# Altium schematic sheet valves.SchDoc: PARSEC Valve Board
size A; Author: Lorenzo; DrawnBy: Lorenzo Shaikewitz; DocumentNumber: Valve Connections; Revision: A
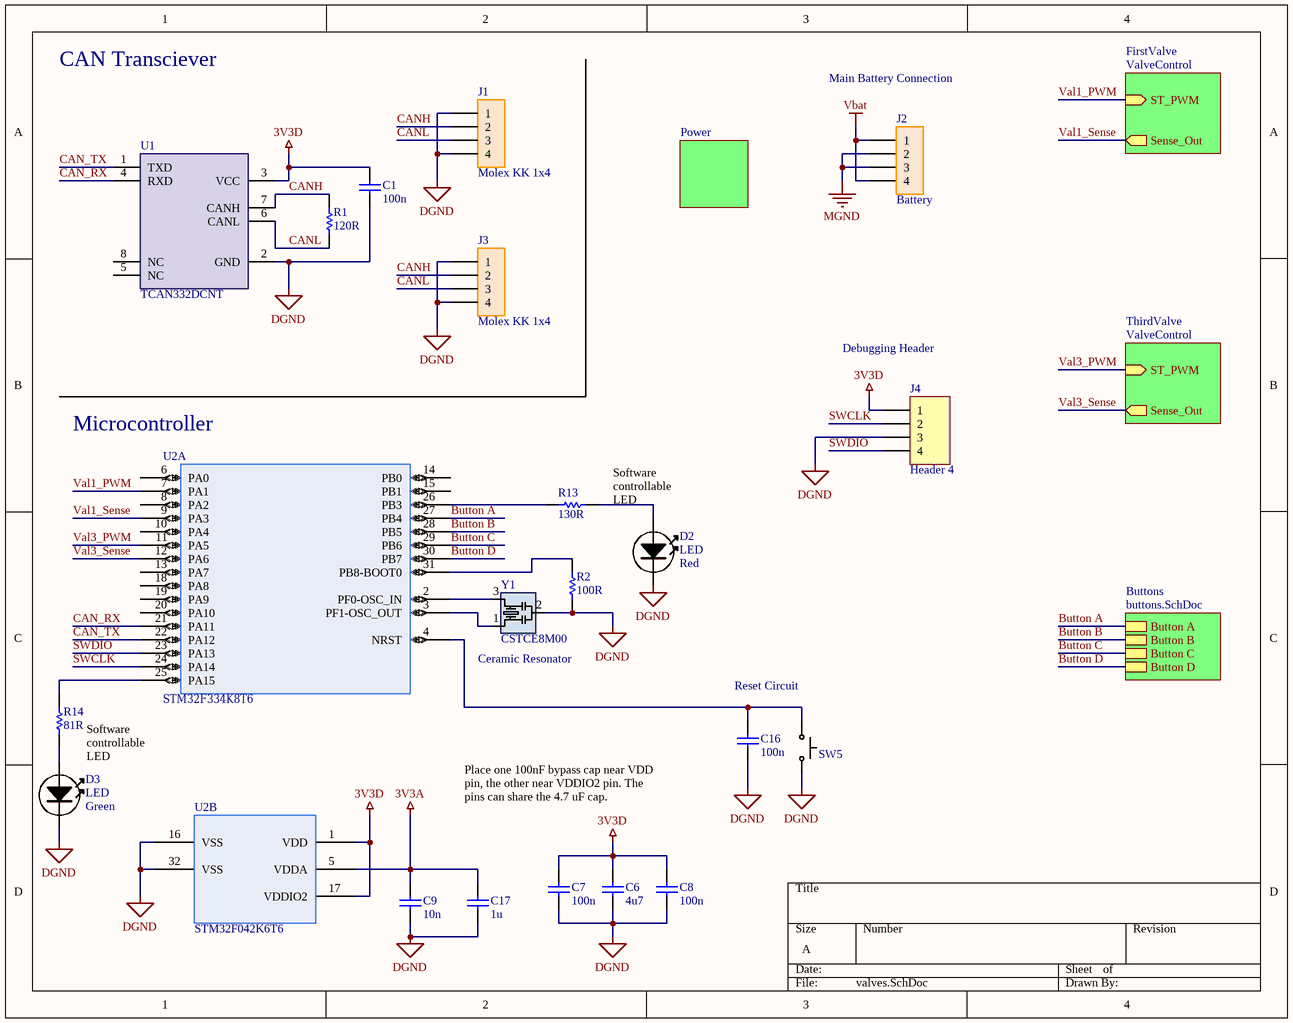
[diagram p0: valves.SchDoc]

## Parts
C1  value 100n  [C0805_med_density]  (hidden comment: CapCer)
C6  value 4u7  [C0603_med_density]  (hidden comment: CapCer)
C7  value 100n  [C0603_med_density]  (hidden comment: CapCer)
C8  value 100n  [C0603_med_density]  (hidden comment: CapCer)
C9  value 10n  [C0603_med_density]  (hidden comment: CapCer)
C16  value 100n  [C0805_med_density]  (hidden comment: CapCer)
C17  value 1u  [C0603_med_density]  (hidden comment: CapCer)
D2  LED  value Red  [LED0805]
D3  LED  value Green  [LED0805]
J1  Molex KK 1x4  [Molex KK 4x1]
J2  Battery  [CON_2074781004_MOL]
J3  Molex KK 1x4  [Molex KK 4x1]
J4  Header 4  [HDR1X4]
R1  value 120R  [R0805_med_density]  (hidden comment: ResChip)
R2  value 100R  [R0805_med_density]  (hidden comment: ResChip)
R13  value 130R  [R0603_med_density]  (hidden comment: ResChip)
R14  value 81R  [R0603_med_density]  (hidden comment: ResChip)
SW5  Switch  [PUSHBUTTON]  (value not drawn)
U1  TCAN332DCNT  [SOT-23-8]
U2  STM32F334K8T6‎  [LQFP-32]  (parts A,B of 2)
Y1  CSTCE8M00  [8MHz Ceramic Resonator]

## Sub-sheets
Buttons = buttons.SchDoc: Button B, Button C, Button D, Button A
Designator = Power: no entries
FirstValve = ValveControl: ST_PWM (in), Sense_Out (out)
ThirdValve = ValveControl: ST_PWM (in), Sense_Out (out)

## Nets
3V3A: C9.1 C17.1 U2.5(VDDA)
3V3D: C1.1 C6.2 C7.2 C8.2 J4.1 U1.3(VCC) U2.1(VDD) U2.17(VDDIO2)
DGND: C1.2 C6.1 C7.1 C8.1 C9.2 C16.1 C17.2 D2.K D3.K J1.1 J1.4 J3.1 J3.4 J4.3 R2.1 SW5.1 U1.2(GND) U2.16(VSS) U2.32(VSS) Y1.2(GND)
MGND: J2.2 J2.3
Vbat: J2.1 J2.4
Button A: U2.27(PB4) ; sheet Buttons/Button A
Button B: U2.28(PB5) ; sheet Buttons/Button B
Button C: U2.29(PB6) ; sheet Buttons/Button C
Button D: U2.30(PB7) ; sheet Buttons/Button D
CAN_RX: U1.4(RXD) U2.21(PA11)
CAN_TX: U1.1(TXD) U2.22(PA12)
CANH: J1.2 J3.2 R1.1 U1.7(CANH)
CANL: J1.3 J3.3 R1.2 U1.6(CANL)
SWCLK: J4.2 U2.24(PA14)
SWDIO: J4.4 U2.23(PA13)
Val1_PWM: U2.7(PA1) ; sheet FirstValve/ST_PWM
Val1_Sense: U2.9(PA3) ; sheet FirstValve/Sense_Out
Val3_PWM: U2.11(PA5) ; sheet ThirdValve/ST_PWM
Val3_Sense: U2.12(PA6) ; sheet ThirdValve/Sense_Out
NetC16_2: C16.2 SW5.2 U2.4(NRST)
NetD2_A: D2.A R13.1
NetD3_A: D3.A R14.1
NetR2_2: R2.2 U2.31(PB8-BOOT0)
NetR13_2: R13.2 U2.26(PB3)
NetR14_2: R14.2 U2.25(PA15)
NetU2_2: U2.2(PF0-OSC_IN) Y1.3(OSC2)
NetU2_3: U2.3(PF1-OSC_OUT) Y1.1(OSC1)

Not connected (* = marked no-connect by the designer): U1 5(NC) 8(NC); U2 6(PA0) 8(PA2) 10(PA4) 13(PA7) 14(PB0) 15(PB1) 18(PA8) 19(PA9) 20(PA10)

## Notes on the sheet
- CAN Transciever
- Main Battery Connection
- Debugging Header
- (near U2) Microcontroller
- Software controllable LED
- (near Y1) Ceramic Resonator
- Reset Circuit
- Place one 100nF bypass cap near VDD pin, the other near VDDIO2 pin. The pins can share the 4.7 uF cap.

## Library data of the parts
C1 C6-C9 C16 C17 = CapCer: SMD Ceramic Capacitor; Rating: 6.3V; Tolerance: *; EIA RS-198 Code: *; Package: *
D2 D3 = LED: Light-emitting diode; Package: *
J1 J3 = Molex KK 1x4: 1x4 Molex KK Connector (CAN)
J2 = 2074781004: Molex 1x4 11A Connector; Vendor: Molex Connector Corporation; Built_By: Molex_Team; SourceLibrary: Molex_2020-09-09; Manufacturer_Part_Number: 2074781004; Copyright: Copyright (C) 2018 Accelerated Designs. All rights reserved; RefDes: RefDes; Type: DEV
J4 = Header 4: Header, 4-Pin; LatestRevisionDate: 17-Jul-2002; LatestRevisionNote: Re-released for DXP Platform.; Publisher: Altium Limited
R1 R13 R14 = ResChip: SMD Chip resistor; Tolerance: *; Rating: *; Package: *
R2 = ResChip: SMD Chip resistor; Tolerance: 1%; Rating: *; Package: *
SW5 = Switch: Push button switch, momentary, normally open
U1 = TCAN332DCNT: IC TXRX CAN 3.3V SOT23-8
U2 = STM32F042K6T6: STM32 MCU; Vendor: STMicroelectronics; Built_By: EMA_UL_Team; SourceLibrary: Updates_to_database_2020-10-19; Manufacturer_Part_Number: STM32F334K8T6‎; Copyright: Copyright (C) 2018 Accelerated Designs. All rights reserved; RefDes: RefDes; Type: DEV
Y1 = CSTCE8M00: 8MHz Ceramic Resonator